# EAGLE schematic schematic-oshtest (EAGLE 6.5.0)
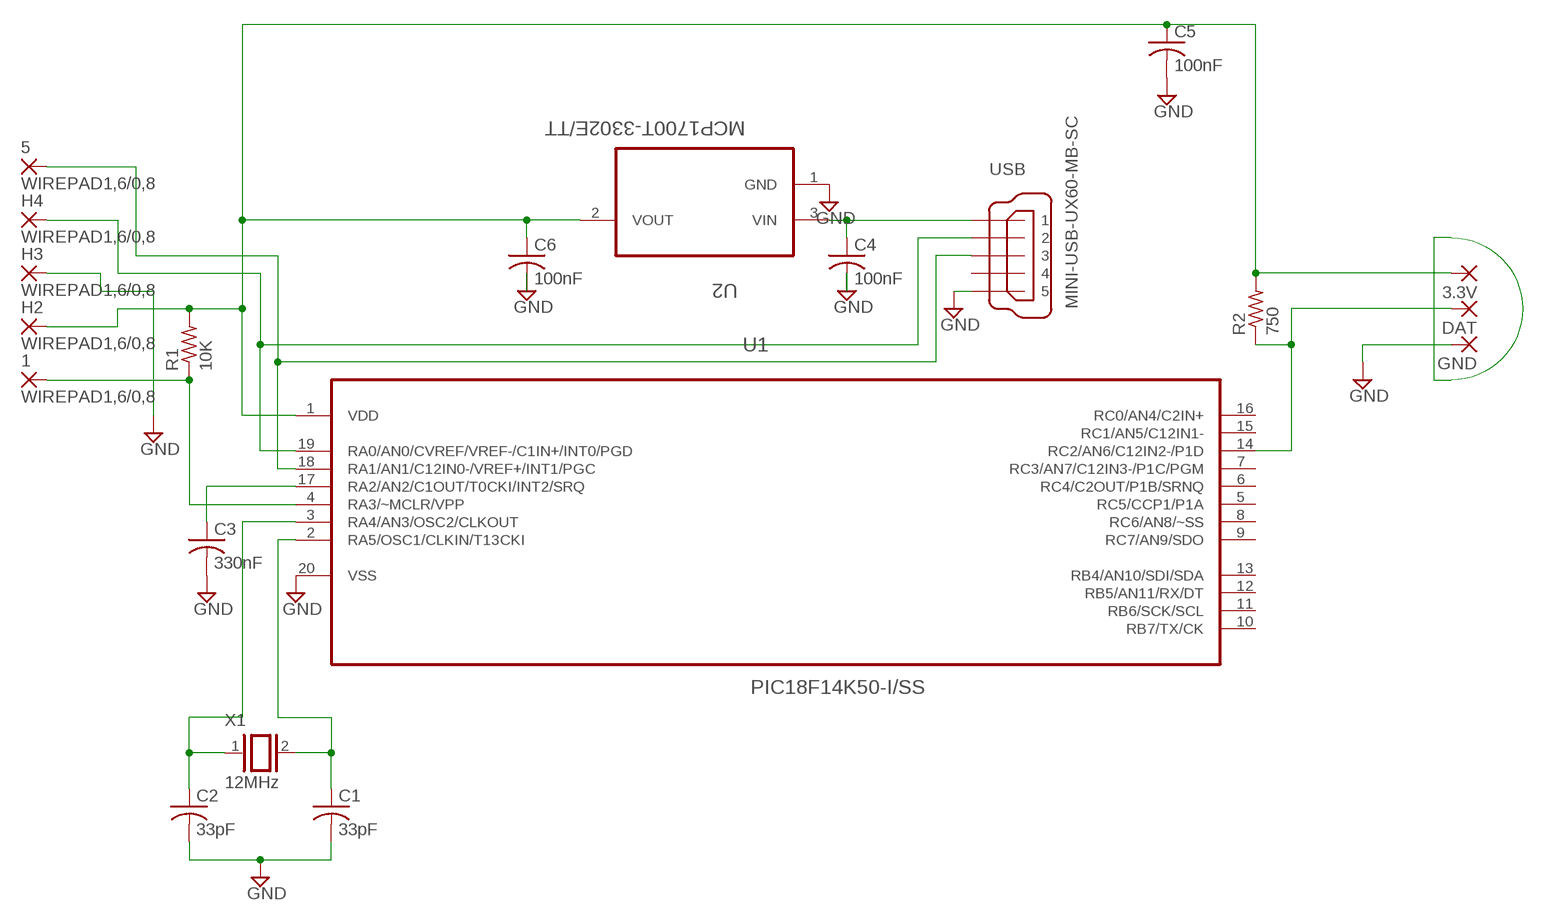
[diagram p0: schematic, sheet 1]

## Parts
1  WIREPAD1,6/0,8  [1,6/0,8]
3.3V  SMD2  [SMD1,27-2,54]
5  WIREPAD1,6/0,8  [1,6/0,8]
C1  33pF  C-USC0402  [C0402]
C2  33pF  C-USC0402  [C0402]
C3  330nF  C-USC0603  [C0603]
C4  100nF  C-USC0402  [C0402]
C5  100nF  C-USC0402  [C0402]
C6  100nF  C-USC0402  [C0402]
DAT  SMD2  [SMD1,27-2,54]
GND  SMD2  [SMD1,27-2,54]
H2  WIREPAD1,6/0,8  [1,6/0,8]
H3  WIREPAD1,6/0,8  [1,6/0,8]
H4  WIREPAD1,6/0,8  [1,6/0,8]
R1  10K  R-US_R0805  [R0805]
R2  750  R-US_R0805  [R0805]
U1  PIC18F14K50-I/SS  [SOP65P780X200-20N]
U2  MCP1700T-3302E/TT  [SOT95P237X112-3N]
USB  MINI-USB-UX60-MB-SC  [UX60-MB-SC]
X1  12MHz  XTAL/S  [QS]

## Nets
GND: C1.2 C2.2 C3.2 C4.2 C5.2 C6.2 GND.1(P) H3.1(P) U1.20(VSS) U2.1(GND) USB.P$5
N$1: C4.1 U2.3(VIN) USB.P$1
N$2: 3.3V.1(P) C5.1 C6.1 H2.1(P) R1.2 R2.2 U1.1(VDD) U2.2(VOUT)
N$3: H4.1(P) U1.19(RA0/AN0/CVREF/VREF-/C1IN+/INT0/PGD) USB.P$2
N$4: 5.1(P) U1.18(RA1/AN1/C12IN0-/VREF+/INT1/PGC) USB.P$3
N$5: 1.1(P) R1.1 U1.4(RA3/~MCLR/VPP)
N$6: C3.1 U1.17(RA2/AN2/C1OUT/T0CKI/INT2/SRQ)
N$7: C1.1 U1.2(RA5/OSC1/CLKIN/T13CKI) X1.2
N$8: C2.1 U1.3(RA4/AN3/OSC2/CLKOUT) X1.1
N$12: DAT.1(P) R2.1 U1.14(RC2/AN6/C12IN2-/P1D)
Unconnected: U1.5(RC5/CCP1/P1A) U1.6(RC4/C2OUT/P1B/SRNQ) U1.7(RC3/AN7/C12IN3-/P1C/PGM) U1.8(RC6/AN8/~SS) U1.9(RC7/AN9/SDO) U1.10(RB7/TX/CK) U1.11(RB6/SCK/SCL) U1.12(RB5/AN11/RX/DT) U1.13(RB4/AN10/SDI/SDA) U1.15(RC1/AN5/C12IN1-) U1.16(RC0/AN4/C2IN+) USB.P$4

## Library data of the parts
1 5 H2-H4 = wirepad:WIREPAD: Wire PAD connect wire on PCB
3.3V DAT GND = wirepad:SMD2: SMD PAD
C1-C6 = rcl:C-US: CAPACITOR, American symbol
R1 R2 = resistor:R-US_: RESISTOR, American symbol
U1 = Microchip_By_element14_Batch_1:PIC18F14K50-I/SS: Flash Microcontrollers; MPN: PIC18F14K50-I/SS; OC_FARNELL: 1648504; OC_NEWARK: 77M3105; PACKAGE: SOP-20; SUPPLIER: Microchip
U2 = microchip:MCP1700T-3302E/TT: Low Quiescent Current LDO; MPN: MCP1700T-3302E/TT; OC_FARNELL: 1296592; OC_NEWARK: 88H9817; PACKAGE: SOT23-3; SUPPLIER: Microchip
USB = Ian_Custom:MINI-USB-: MINI USB Connector Source: http://www.hirose.co.jp/cataloge_hp/e24000019.pdf
X1 = special:XTAL/S: CRYSTAL

## Net classes
0 default: width 0.254 mm, drill 0.61 mm, clearance 0.203 mm